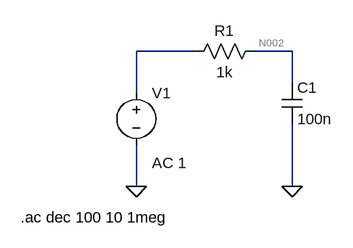
[diagram p0: schematic Draft ep2.asc]
Draft ep2.asc, the LTspice schematic file:
Version 4
SHEET 1 880 680
WIRE 272 96 176 96
WIRE 416 96 352 96
WIRE 416 144 416 96
WIRE 176 160 176 96
WIRE 176 304 176 240
WIRE 416 304 416 208
FLAG 176 304 0
FLAG 416 304 0
SYMBOL voltage 176 144 R0
WINDOW 123 24 124 Left 2
WINDOW 39 0 0 Left 0
SYMATTR InstName V1
SYMATTR Value ""
SYMATTR Value2 AC 1
SYMBOL res 368 80 R90
WINDOW 0 0 56 VBottom 2
WINDOW 3 32 56 VTop 2
SYMATTR InstName R1
SYMATTR Value 1k
SYMBOL cap 400 144 R0
SYMATTR InstName C1
SYMATTR Value 100n
TEXT -2 352 Left 2 !.ac dec 100 10 1meg

The netlist it stands for:
* Draft ep2.asc
V1 N001 0 AC 1
R1 N002 N001 1k
C1 N002 0 100n
.ac dec 100 10 1meg
.backanno
.end

* Results of the author's LTspice run, read from the files saved beside the schematic
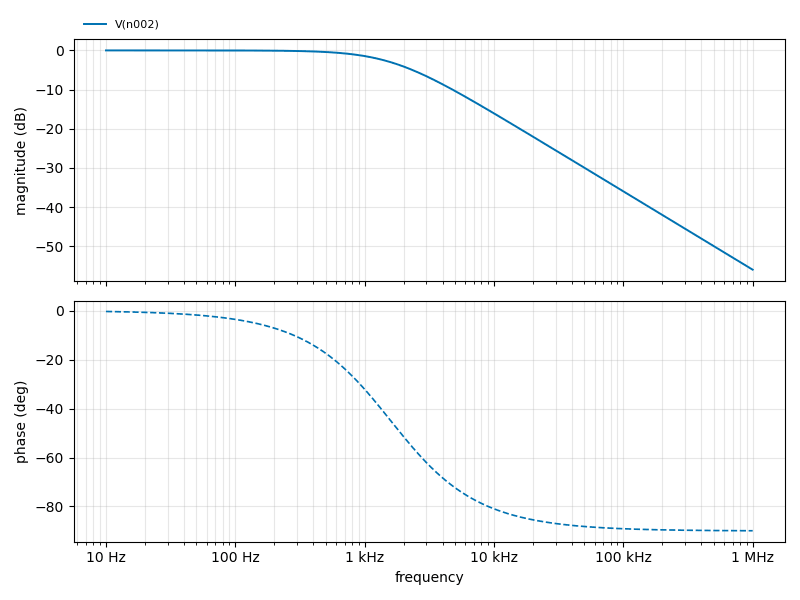
[diagram p1: AC Analysis of Draft ep2.asc, plotted from the saved traces]
* AC Analysis, 1 run:
*   V(n002): -0.00 dB at 10 Hz, -55.96 dB at 1 MHz, peak -0.00 dB at 10 Hz, 3 dB below the peak at 1.592 kHz